# EasyEDA Pro project ProDoc_PCB2_2025-12-06.epro

# Board PCB2
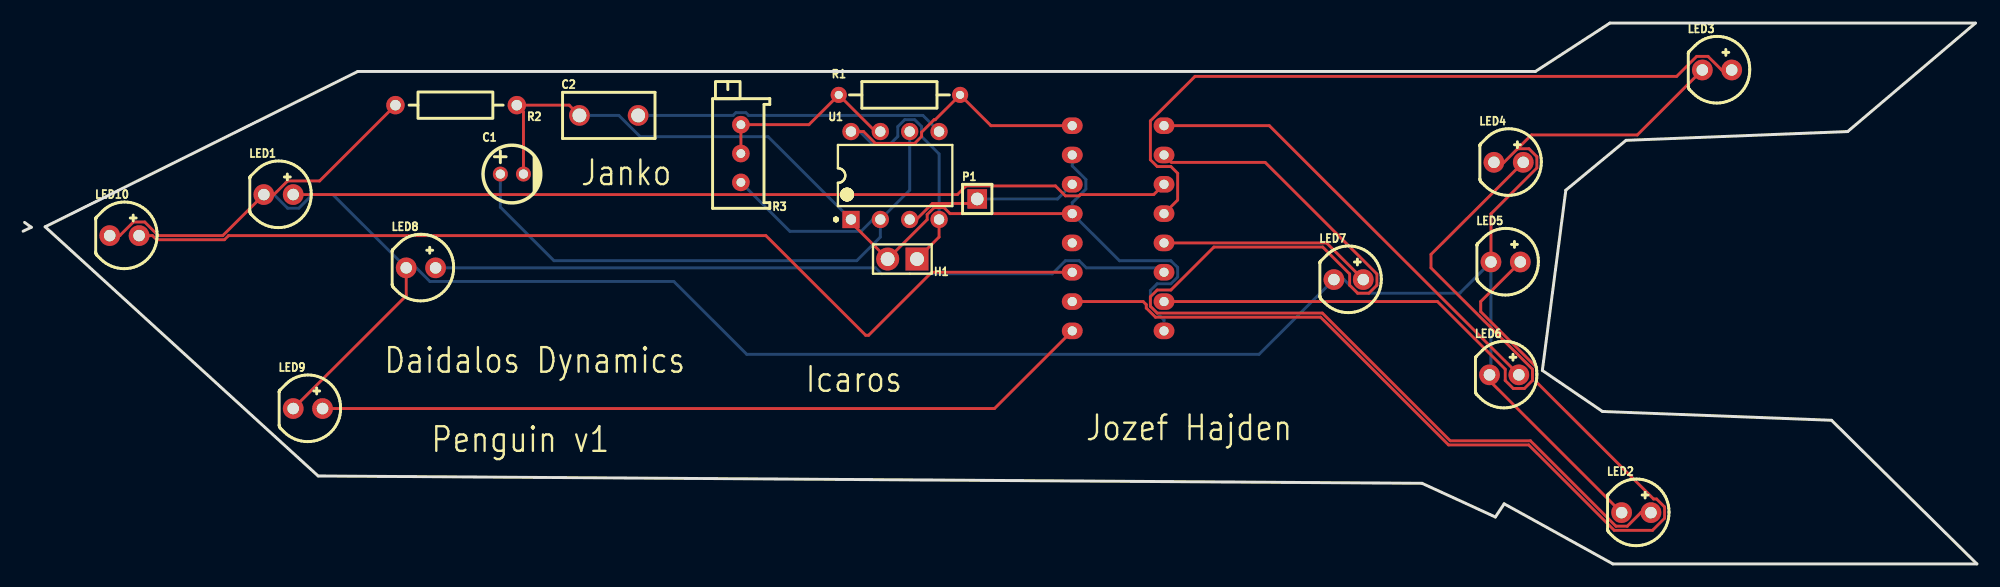
[diagram p0: board, top side]
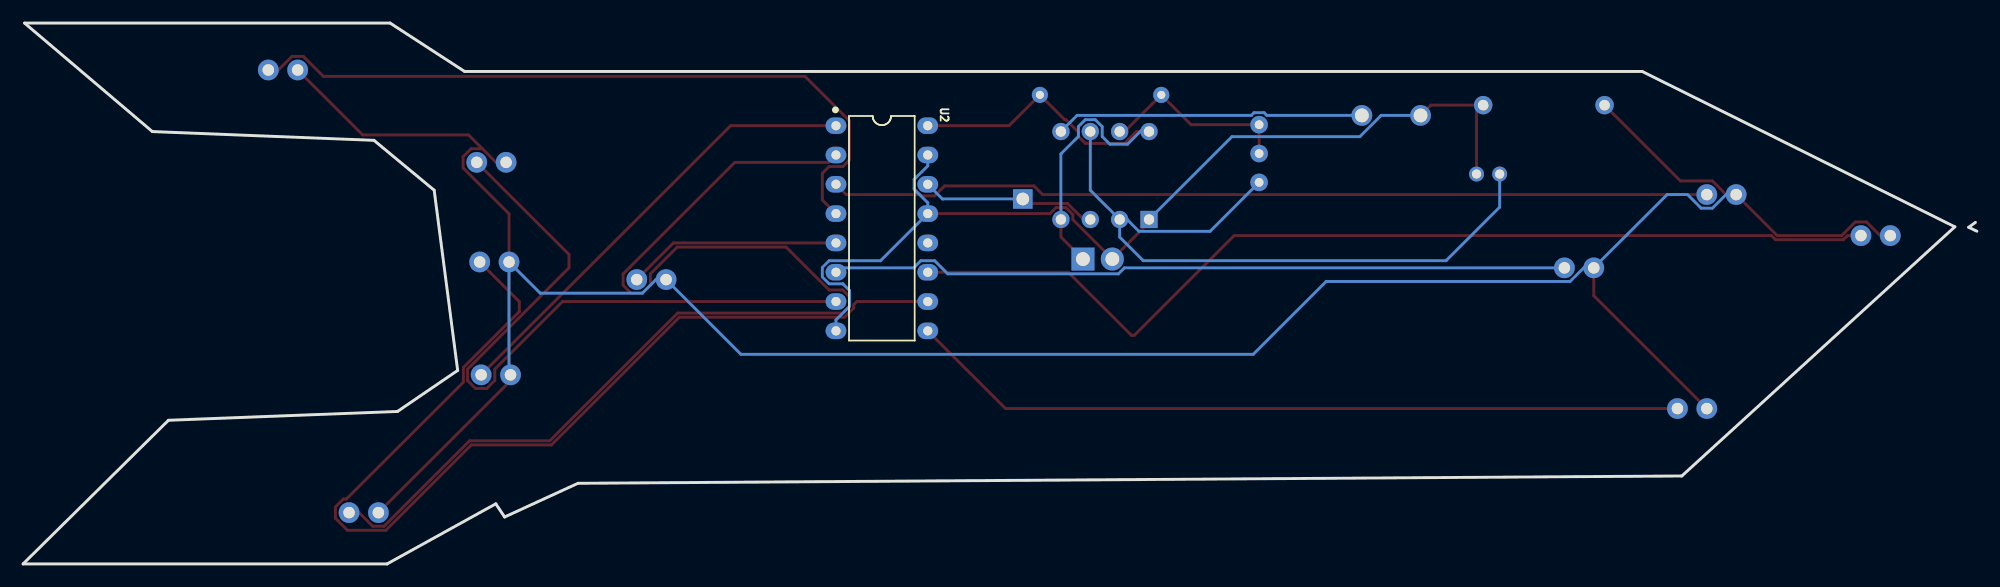
[diagram p1: board, bottom side, seen from below]

Outline 169.04 x 46.86 mm; copper layers: Top Layer, Bottom Layer. Coordinates in mm from the lower left corner of the outline.
Outline path: 0,28.83 0.71,29.17 0.13,29.59 ; 1.9,29.21 28.96,42.67 130.84,42.67 137.29,46.86 168.92,46.86 157.86,37.46 138.68,36.7 133.48,32.38 131.44,16.76 136.65,13.21 156.46,12.45 169.04,0 137.55,0 128.14,5.21 127.38,4.06 121.03,6.98 25.53,7.62 1.9,29.21
Stack: Top Layer 0.035mm / Dielectric1 1.51mm FR4 er 4.5 / Bottom Layer 0.035mm

## Design rules (mm)
template: JLCPCB Capability(Two Layers Board)
spacing copperThickness1oz (default): track to track 0.102, other pairs 0.152 to 0.3
spacing copperThickness2oz: track to track 0.203, other pairs 0.152 to 0.3
track width copperThickness1oz (default): min 0.127, default 0.254, max 2.54
track width copperThickness2oz: min 0.203, default 0.254, max 2.54
differential pair differentialPair (default): width min 0.127, default 0.254, max 2.54; gap min 0.152, default 0.152
via viaSize (default): diameter min 0.5, default 0.61, max 10; hole min 0.3, default 0.305, max 6.3

## Placement (name value [footprint] x y rotation side)
C1  1uF  [CAP-TH_BD5.0-P2.00-D0.8-FD]  42.29 33.78 0 top
C2  10nF  [CAP-TH_L8.0-W4.0-P5.00-D1.2]  50.67 38.86 0 top
H1  PZ254V-11-02P  [HDR-TH_2P-P2.54-V-M]  76.07 26.42 180 top
LED1  XL-502UWC  [LED-TH_BD5.9-P2.54-RD_WHITE]  22.1 32 0 top
LED2  XL-502UWC  [LED-TH_BD5.9-P2.54-RD_WHITE]  139.57 4.44 0 top
LED3  XL-502UWC  [LED-TH_BD5.9-P2.54-RD_WHITE]  146.56 42.8 0 top
LED4  XL-502UWC  [LED-TH_BD5.9-P2.54-RD_WHITE]  128.52 34.8 0 top
LED5  XL-502UWC  [LED-TH_BD5.9-P2.54-RD_WHITE]  128.27 26.16 0 top
LED6  XL-502UWC  [LED-TH_BD5.9-P2.54-RD_WHITE]  128.14 16.38 0 top
LED7  XL-502UWC  [LED-TH_BD5.9-P2.54-RD_WHITE]  114.68 24.64 0 top
LED8  XL-502UWC  [LED-TH_BD5.9-P2.54-RD_WHITE]  34.42 25.65 0 top
LED9  XL-502UWC  [LED-TH_BD5.9-P2.54-RD_WHITE]  24.64 13.46 0 top
LED10  XL-502UWC  [LED-TH_BD5.9-P2.54-RD_WHITE]  8.76 28.45 0 top
P1  2.54-1*1P针  [HDR-TH_1P-P2.54-V-M]  82.55 31.62 0 top
R1  1kΩ  [RES-TH_BD2.3-L6.5-P10.50-D0.5]  75.82 40.64 0 top
R2  470Ω  [RES-TH_BD2.2-L6.5-P10.50-D0.6]  37.46 39.75 180 top
R3  50kΩ  [RES-ADJ-TH_3P-L9.5-W4.85-P2.50-BL-L]  62.1 35.56 180 top
U1  NE555P  [DIP-8_L9.8-W6.6-P2.54-LS7.6-BL]  75.44 33.65 0 top
U2  CD4017BE(LX)  [PDIP-16_L19.3-W6.4-P2.54-LS7.94-BL]  94.74 29.08 270 bottom

## Footprints (pads in the part's own frame, mm; a bottom-side part is the same pattern mirrored in y, then rotated)
CAP-TH_BD5.0-P2.00-D0.8-FD
  round 1.3 hole 0.8: 1(-1,0) 2(1,0)
CAP-TH_L8.0-W4.0-P5.00-D1.2
  round 1.8 hole 1.2: 1(-2.54,0) 2(2.54,0)
DIP-8_L9.8-W6.6-P2.54-LS7.6-BL
  rect 1.5x1.5 hole 0.9: 1(-3.81,-3.81)
  round 1.5 hole 0.9: 2(-1.27,-3.81) 3(1.27,-3.81) 4(3.81,-3.81) 5(3.81,3.81) 6(1.27,3.81) 7(-1.27,3.81) 8(-3.81,3.81)
HDR-TH_1P-P2.54-V-M
  rect 1.7x1.7 hole 1.1: 1(0,0)
HDR-TH_2P-P2.54-V-M
  rect 2x2 hole 1.2: 1(-1.27,0)
  round 2 hole 1.2: 2(1.27,0)
LED-TH_BD5.9-P2.54-RD_WHITE
  round 1.8 hole 1: 1(-1.27,0) 2(1.27,0)
PDIP-16_L19.3-W6.4-P2.54-LS7.94-BL
  oval 1.44x1.8 hole 0.8: 1(-8.89,-3.97) 2(-6.35,-3.97) 3(-3.81,-3.97) 4(-1.27,-3.97) 5(1.27,-3.97) 6(3.81,-3.97) 7(6.35,-3.97) 8(8.89,-3.97) 9(8.89,3.97) 10(6.35,3.97) 11(3.81,3.97) 12(1.27,3.97) 13(-1.27,3.97) 14(-3.81,3.97) 15(-6.35,3.97) 16(-8.89,3.97)
RES-ADJ-TH_3P-L9.5-W4.85-P2.50-BL-L
  round 1.524 hole 0.762: 1(0,2.5) 2(0,0) 3(0,-2.5)
RES-TH_BD2.2-L6.5-P10.50-D0.6
  round 1.6 hole 0.914: 1(-5.25,0) 2(5.25,0)
RES-TH_BD2.3-L6.5-P10.50-D0.5
  round 1.4 hole 0.7: 1(-5.25,0) 2(5.25,0)

## Nets
$1N2955: LED1.1 LED2.1 LED3.1 LED4.1 LED5.1 LED6.1 LED7.1 LED8.1 LED9.1 LED10.1 R2.2
$1N3294: C2.2 U1.5
$1N3315: R1.1 R3.2 R3.3 U1.7
$1N3337: H1.1 R1.2 U1.4 U1.8 U2.16
$1N3689: LED7.2 U2.5
$1N3705: LED10.2 U2.11
$1N3719: LED9.2 U2.9
$1N3788: LED8.2 U2.6
$1N3802: LED6.2 U2.1
$1N3810: LED5.2 U2.10
$1N3820: LED4.2 U2.7
$1N3827: LED3.2 U2.4
$1N3834: LED2.2 U2.2
$1N3841: LED1.2 U2.3
$1N3852: C1.1 R3.1 U1.2 U1.6
$1N3898: C1.2 C2.1 H1.2 R2.1 U1.1 U2.8 U2.13 U2.15
$1N4088: P1.1 U1.3 U2.14

Pads without a net: U2 12

## Routing (per net, layer and track width the routed paths; a pad name or vN(x,y) marks a point on that pad's centre or on a via; arc(x,y) is an arc through that point)
$1N2955: length 224.4
  Top Layer w0.254: 129.31,35.98 130.5,37.17 139.66,37.17 LED3.1 ; 129.31,35.98 130.28,35.98 130.97,35.29 130.97,34.31 127,30.34 LED5.1 ; 129.31,35.98 128.13,34.8 LED4.1 ; LED2.1 126.87,15.87 LED6.1 ; R2.2 25.65,33.18 22.88,33.18 21.7,32 LED1.1 17.27,28.45 11.7,28.45 10.52,29.63 9.54,29.63 8.37,28.45 LED10.1 ; LED9.1 33.15,23.24 LED8.1
  Bottom Layer w0.254: LED1.1 21.7,32 22.88,30.82 23.86,30.82 25.04,32 26.8,32 LED8.1 34.02,25.65 35.2,24.47 56.3,24.47 62.61,18.16 106.93,18.16 LED7.1 114.28,24.64 115.46,23.46 124.3,23.46 LED5.1 127,16.51 LED6.1
$1N3294: length 26.8
  Bottom Layer w0.254: U1.5 77.85,38.86 62.77,38.86 62.53,39.1 61.67,39.1 61.43,38.86 C2.2
$1N3315: length 16.2
  Top Layer w0.254: U1.7 73.74,37.46 R1.1 67.99,38.06 R3.3 62.1,36.32
$1N3337: length 43.9
  Top Layer w0.254: U2.16 83.74,37.97 R1.2 78.92,38.49 78.82,38.49 77.74,37.41 77.74,37.04 77.13,36.44 73.74,36.44 72.71,37.46 U1.8 ; H1.1 79.25,28.32 U1.4
  Bottom Layer w0.254: U1.8 71.88,37.72 72.14,37.72 73.49,36.37 75.01,36.37 75.68,37.04 75.68,37.89 76.28,38.49 77.13,38.49 77.74,37.89 77.74,37.04 79.25,35.53 U1.4
$1N3689: length 18.6
  Top Layer w0.254: LED7.2 112.78,27.81 U2.5
$1N3705: length 86.9
  Top Layer w0.254: U2.11 78.61,25.27 73.15,19.81 72.9,19.81 64.26,28.45 17.78,28.45 17.42,28.09 11.55,28.09 11.2,28.45 LED10.2
$1N3719: length 67.7
  Top Layer w0.254: LED9.2 84.04,13.46 U2.9
$1N3788: length 64.1
  Bottom Layer w0.254: U2.6 98.33,25.65 91.98,25.65 91.37,26.27 90.18,26.27 89.04,25.14 74.27,25.14 73.76,25.65 LED8.2
$1N3802: length 39.6
  Top Layer w0.254: U2.1 107.82,37.97 LED6.2
$1N3810: length 90.4
  Top Layer w0.254: LED5.2 126.11,22.73 126.11,21.86 130.95,17.02 130.95,15.75 141.07,5.62 141.33,5.62 142.02,4.93 142.02,3.96 140.98,2.91 137.67,2.91 130.26,10.31 123.33,10.31 112.26,21.38 97.97,21.38 97.18,22.17 97.18,22.47 96.91,22.73 U2.10
$1N3820: length 61.7
  Top Layer w0.254: U2.7 122.37,22.73 128.23,16.87 128.23,15.89 128.92,15.2 129.9,15.2 130.59,15.89 130.59,16.87 121.81,25.65 121.81,26.82 LED4.2
$1N3827: length 63.3
  Top Layer w0.254: U2.4 99.89,31.53 99.89,33.85 99.31,34.43 98.12,34.43 97.53,35.02 97.53,38.39 101.39,42.24 143.07,42.24 144.8,43.98 145.78,43.98 146.96,42.8 LED3.2
$1N3834: length 100.1
  Top Layer w0.254: U2.2 99.35,34.79 107.47,34.79 117.13,25.13 117.13,24.15 116.44,23.46 115.46,23.46 114.77,24.15 114.77,25.13 112.44,27.46 103.03,27.46 99.31,23.73 98.12,23.73 97.53,23.15 97.53,22.32 98.12,21.73 112.41,21.73 123.48,10.67 130.41,10.67 137.81,3.27 138.79,3.27 139.97,4.44 LED2.2
$1N3841: length 76.4
  Top Layer w0.254: LED1.2 80.84,32 81.58,32.75 89.32,32.75 90.18,31.89 91.37,31.89 91.48,32 97.82,32 U2.3
$1N3852: length 63
  Bottom Layer w0.254: R3.1 66.35,28.82 72.49,28.82 73.52,29.84 U1.2 ; U1.2 76.71,32.38 U1.6 ; U1.2 74.17,28.32 72.12,26.28 45.93,26.28 41.29,30.91 C1.1
$1N3898: length 87
  Top Layer w0.254: 48.13,38.86 47.24,39.75 R2.1 43.29,39.17 C1.2 ; U2.13 80.19,30.35 79.67,30.87 78.82,30.87 78.22,30.27 78.22,29.83 H1.2 71.63,29.59 U1.1
  Bottom Layer w0.254: U1.1 64.45,37.02 53.39,37.02 51.55,38.86 48.13,38.86 ; U2.8 98.71,21.14 97.53,22.32 97.53,23.69 98.12,24.27 99.31,24.27 99.89,24.86 99.89,25.69 99.31,26.27 94.85,26.27 U2.13 90.77,31.3 91.95,32.48 91.95,33.31 90.77,34.49 U2.15
$1N4088: length 15.3
  Top Layer w0.254: P1.1 82.16,31.23 78.67,31.23 77.29,29.84 U1.3
  Bottom Layer w0.254: U2.14 89.5,31.62 P1.1

## Text on the board
Top Silkscreen Layer: Daidalos Dynamics | Penguin v1 | Janko | Icaros | Jozef Hajden
